# Altium schematic sheet v1.0.SchDoc
size 129 x 68 mm
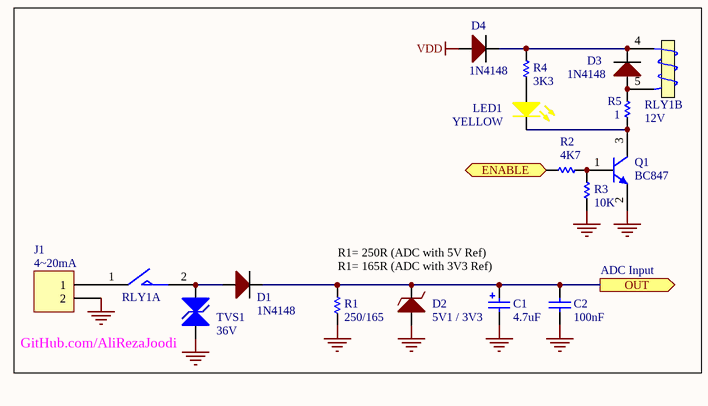
[diagram p0: v1.0.SchDoc]

## Parts
C1  4.7uF  [CAPPR2.5-6.3x5]
C2  100nF  [CAPNTO2.54-3.05x1.78A]
D1  1N4148  [D_THD_AXIAL0.3_DO-35]
D2  5V1 / 3V3  [D_THD_AXIAL0.3_DO-35]
D3  1N4148  [D_THD_AXIAL0.3_DO-35]
D4  1N4148  [D_THD_AXIAL0.3_DO-35]
J1  Header 2  [Fonics_2PIN_1]  (value not drawn)
LED1  YELLOW  [LED_THD_3MM_YELLOW_R]
Q1  Q1  value BC847  [SOT23-3N]
R1  250/165  [R_THD_AXIAL0.4(1/4W)]
R2  4K7  [R_THD_AXIAL0.4(1/4W)]
R3  10K  [R_THD_AXIAL0.4(1/4W)]
R4  3K3  [R_THD_AXIAL0.4(1/4W)]
R5  1  [R_THD_AXIAL0.4(1/4W)]
RLY1  RELAU  [RELAY-SPDT-2]  (value not drawn)  (parts A,B of 2)
TVS1  36V  [D_THD_AXIAL0.6_DO-27_DO-201A_2Form]

## Ports
ENABLE (in), OUT (out)

## Nets
GND: C1.2 C2.1 D2.1 J1.2 Q1.2(E) R1.2 R3.1 TVS1.1
VDD: D4.1(A)
ENABLE: R2.2 ; port ENABLE
OUT: C1.1 C2.2 D1.2(K) D2.2 R1.1 ; port OUT
NetD1_1: D1.1(A) RLY1.2(NO) TVS1.2
NetD3_1: D3.1(A) R5.1 RLY1.5(T2)
NetD3_2: D3.2(K) D4.2(K) R4.2 RLY1.4(T1)
NetJ1_1: J1.1 RLY1.1(COM)
NetLED1_1: LED1.1(A) R4.1
NetLED1_2: LED1.2(K) Q1.3(C) R5.2
NetQ1_1: Q1.1(B) R2.1 R3.2

## Notes on the sheet
- (near J1) 4~20mA
- R1= 250R (ADC with 5V Ref)
  R1= 165R (ADC with 3V3 Ref)
- ADC Input
- (near TVS1) GitHub.com/AliRezaJoodi

## Library data of the parts
C1 = Cap Pol1: Polarized Capacitor (Radial); Manufacturer: Generic Components; Class I: Passive; Published: 8-Jun-2000; Revision: July-2002: Re-released for DXP Platform.; Publisher: Altium Limited; Class II: Capacitor
C2 = Cap: Capacitor; Manufacturer: Generic Components; Class I: Passive; Published: 8-Jun-2000; Revision: July-2002: Re-released for DXP Platform.; Publisher: Altium Limited; Class II: Capacitor
D1 D3 D4 = Diode_2Form: Diode,; Revision: July-2002: Re-released for DXP Platform.
D2 = Diode_Zener: Diode, Zener; Revision: July-2002: Re-released for DXP Platform.
J1 = Header 2: Header, 2-Pin; LatestRevisionDate: 17-Jul-2002; LatestRevisionNote: Re-released for DXP Platform.; Publisher: Altium Limited
LED1 = LED_YELLOW: LED, Yellow; Manufacturer: Generic Components; Class I: Optoelectronic; Published: 8-Jun-2000; Revision: July-2002: Re-released for DXP Platform.; Publisher: Altium Limited; Class II: LED
Q1 = BC847: Silicon Bipolar Transistor
R1-R5 = Resistor: Revision: July-2002: Re-released for DXP Platform.
RLY1 = RELAY-NY12W-K: Value: LM358; Published: 17-Jul-2002; LatestRevisionDate: 13-Apr-2006; LatestRevisionNote: IPC-7351 Footprint Added.; DatasheetVersion: 1988; PackageReference: 751-02; Publisher: Altium Limited; PackageDescription: 8-Pin Small Outline Integrated Circuit 1.27 mm Pitch; Code_JEDEC: MS-012-AA; Code_IPC: SOIC127P600-8; ComponentLink1Description: Manufacturer Link; ComponentLink1URL: http://www.onsemi.com/site/products/parametrics/0,4446,251,00.html; ComponentLink2Description: Datasheet; ComponentLink2URL: http://www.onsemi.com/pub/Collateral/LM358-D.PDF
TVS1 = Diode_TVS: Diode, TVS; Revision: July-2002: Re-released for DXP Platform.